# EAGLE design DigiDendro (EAGLE 9.6.2)
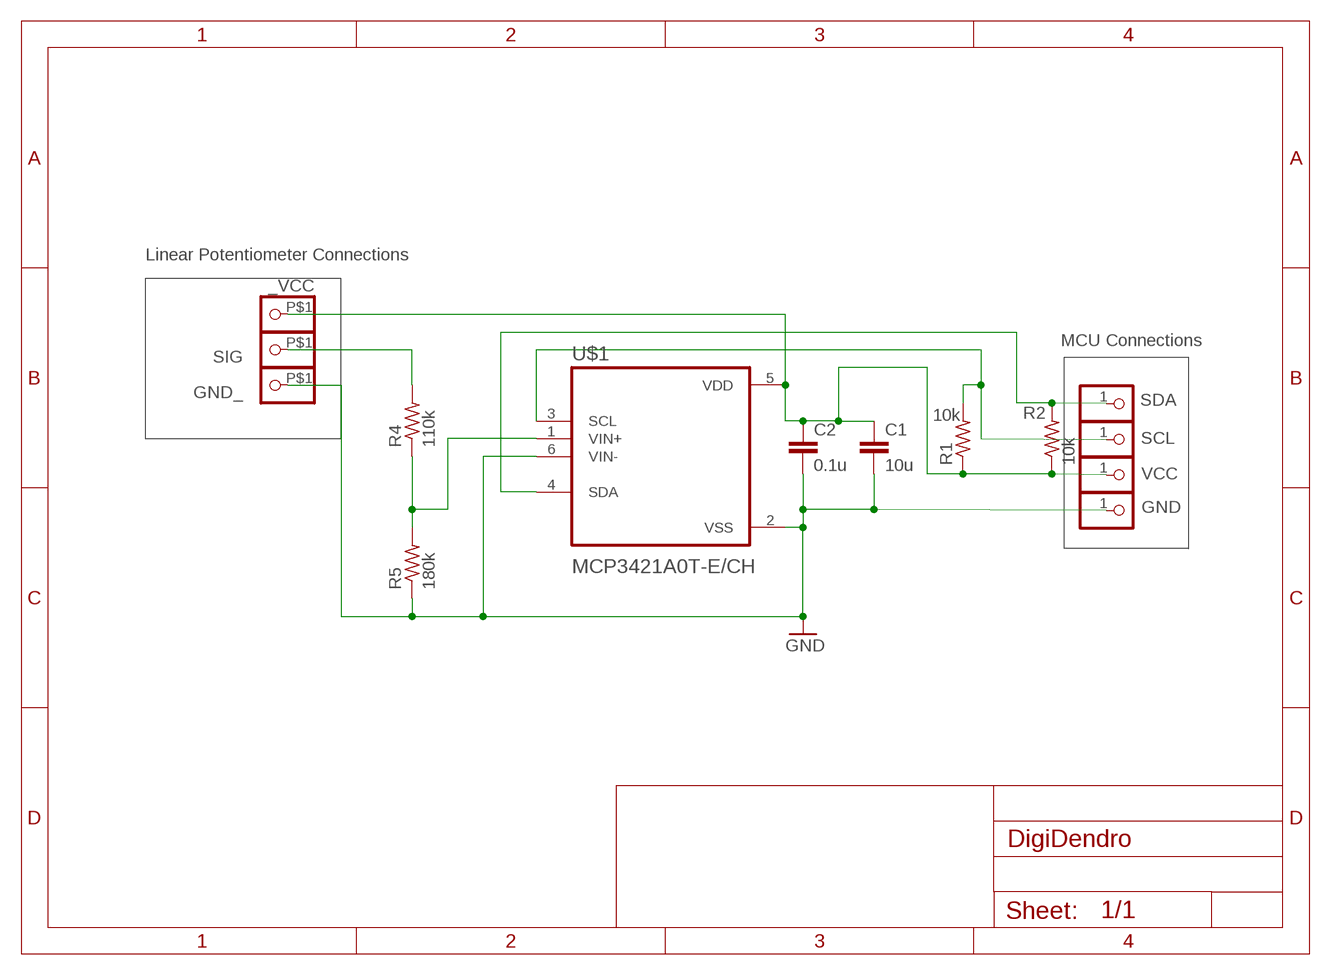
[diagram p0: schematic, sheet 1]

## Parts
_VCC  PINHD-1X1-BIGPOGO  [1X1-BIGPOGO]
C1  10u  C-EUC0805  [C0805]
C2  0.1u  C-EUC0805  [C0805]
GND  PINHD-1X1  [1X01]
GND_  PINHD-1X1-BIGPOGO  [1X1-BIGPOGO]
R1  10k  R-US_R0603  [R0603]
R2  10k  R-US_R0603  [R0603]
R4  110k  R-US_R0603  [R0603]
R5  180k  R-US_R0603  [R0603]
SCL  PINHD-1X1  [1X01]
SDA  PINHD-1X1  [1X01]
SIG  PINHD-1X1-BIGPOGO  [1X1-BIGPOGO]
U$1  MCP3421A0T-E/CH  [SOT95P280X145-6N]
VCC  PINHD-1X1  [1X01]

## Nets
GND: C1.2 C2.2 GND.1 GND_.P$1 R5.1 U$1.2(VSS) U$1.6(VIN-)
N$2: R4.2 SIG.P$1
N$3: R4.1 R5.2 U$1.1(VIN+)
SCL: R1.2 SCL.1 U$1.3(SCL)
SDA: R2.2 SDA.1 U$1.4(SDA)
VCC: _VCC.P$1 C1.1 C2.1 R1.1 R2.1 U$1.5(VDD) VCC.1

## Notes on the sheet
- Linear Potentiometer Connections
- MCU Connections

## Library data of the parts
_VCC GND_ SIG = adafruit:PINHD-1X1: Pin header 1x1 for 0.1" spacing With round pins
C1 C2 = rcl:C-EU: CAPACITOR, European symbol; SPICEPREFIX: C
GND SCL VCC = pinhead:PINHD-1X1: PIN HEADER
R1 R2 R4 R5 = adafruit:R-US_: RESISTOR, American symbol
SDA = pinhead:PINHD-1X1: PIN HEADER; SPICEPREFIX: X
U$1 = MCP3421A0T-E_CH:MCP3421A0T-E/CH: Check availability <https://pricing.snapeda.com/parts/MCP3421A0T-E/CH/Microchip/view-part?ref=eda>; AVAILABILITY: In Stock; CHECK_PRICES: https://www.snapeda.com/parts/MCP3421A0T-E/CH/Microchip/view-part/?ref=eda; DESCRIPTION: Microchip 18 bit Serial ADC Differential Input 6-Pin SOT-23 | Microchip Technology Inc. MCP3421A0T-E/CH; MF: Microchip; MP: MCP3421A0T-E/CH; PACKAGE: SOT-23-6 Microchip; PRICE: None; PURCHASE-URL: https://www.snapeda.com/api/url_track_click_mouser/?unipart_id=13241&manufacturer=Microchip&part_name=MCP3421A0T-E/CH&search_term=None; SNAPEDA_LINK: https://www.snapeda.com/parts/MCP3421A0T-E/CH/Microchip/view-part/?ref=snap

## Board
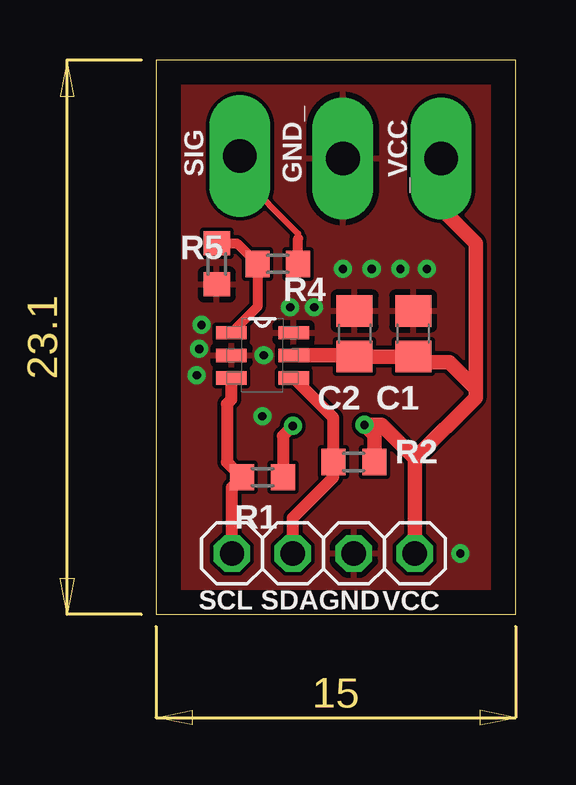
[diagram p1: board, top side]
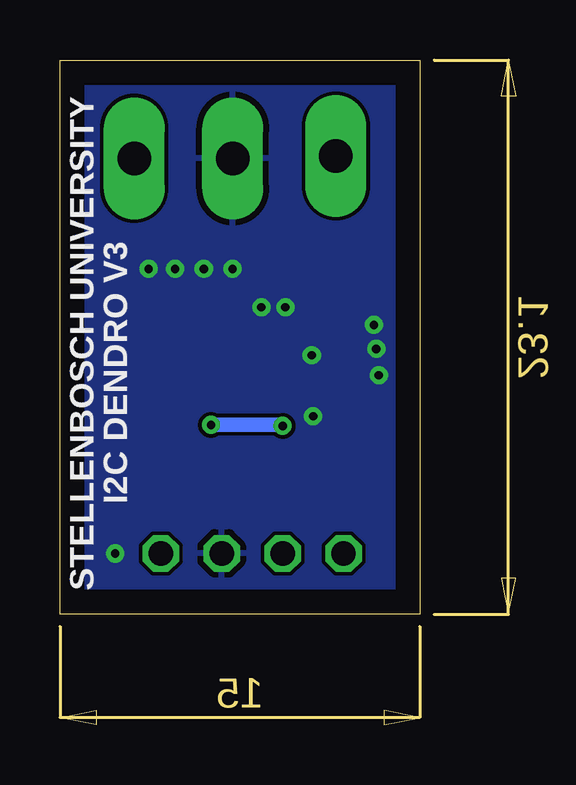
[diagram p2: board, bottom side, seen from below]

Size 15 x 23.1 mm. Coordinates in mm from the lower left corner, seen from the top.
Outline: 0,0 15,0 15,23.1 0,23.1 0,0
Copper layers (1*16): Top 0.035mm / dielectric 1.5mm / Bottom 0.035mm
Design rules "default": minimum track width 6mil, minimum drill 0.35mm, track to track 6mil, track to pad 6mil, pad to pad 6mil, via to via 6mil, smd to smd 6mil, copper to edge 40mil, drill to drill 6mil, minimum pad ring 10mil, minimum via ring 8mil, stop-mask expansion 4mil, vias tented up to drill 0mil, thermal gap 10mil

### Footprints (pad centres in the part's own frame; a part is rotated, then mirrored left to right if it is on the bottom)
1X1-BIGPOGO = drill 1.4 pad 2.54 long: P$1 0,0
C0805 = smd 1.3 x 1.5: 1 -0.95,0; 2 0.95,0
1X01 = drill 1.016 octagon: 1 0,0
R0603 = smd 1 x 1.1: 1 -0.85,0; 2 0.85,0
SOT95P280X145-6N = smd 1.27 x 0.559: 1 -1.295,0.94; 2 -1.295,0; 3 -1.295,-0.94; 4 1.295,-0.94; 5 1.295,0; 6 1.295,0.94

### Placement (x,y rotation side)
_VCC  11.9,19 90 top
C1  10.73,11.7 90 top
C2  8.29,11.7 90 top
GND  8.26,2.54 0 top
GND_  7.8,19 90 top
R1  4.45,5.71 180 top
R2  8.26,6.35 180 top
R4  5.08,14.61 0 top
R5  2.54,14.61 90 top
SCL  3.17,2.54 0 top
SDA  5.71,2.54 0 top
SIG  3.5,19.1 90 top
U$1  4.45,10.79 0 top
VCC  10.79,2.54 0 top

### Tracks (layer width: path | path; a pad name or v marks a point on that pad's centre or on a via)
GND  (via drill 0.35)
  other vias: 4.45,8.26 7.8,14.4 9,14.4 10.2,14.4 12.7,2.54 1.91,12.06 11.3,14.4 6.6,12.8 5.6,12.8 4.5,10.8 1.8,11.06 1.71,9.96
  pour Top: 0,23.1 0,0 15,0 15,23.1
  pour Bottom: 0,23.1 0,0 15,0 15,23.1
N$2
  Top 0.254: 5.93,15.67 5.93,15.87 3.5,18.3 SIG.P$1
  Top 0.406: R4.2 5.93,15.67
N$3
  Top 0.406: R5.2 3.38,15.46 R4.1 4.23,12.81 U$1.1
SCL
  Top 0.508: SCL.1 3.17,5.29 R1.2 2.96,6.35 2.96,8.78 3.15,8.96 U$1.3
SDA
  Top 0.508: U$1.4 7.41,8.19 R2.2 7.41,5.71 5.71,4.03 SDA.1
VCC  (via drill 0.35)
  Top 0.508: 9.11,6.13 R2.1 | v5.71,7.86 5.29,7.43 R1.1
  Top 0.61: _VCC.P$1 11.9,16.9 13.34,15.46 13.34,9.4 | 9.11,6.13 9.11,7.5 v8.7,7.9 9.4,7.9 10.79,6.5 | 10.79,6.5 VCC.1 | 13.34,9.4 13.34,9.04 10.8,6.5 10.79,6.5 | 13.34,9.4 12.23,10.5 10.97,10.5 C1.1 C2.1 8.24,10.79 U$1.5
  Bottom 0.61: v5.71,7.86 5.76,7.9 v8.7,7.9

### Text on the board
bNames: I2C DENDRO V3 | STELLENBOSCH UNIVERSITY